# Altium schematic sheet Display.Schematic.SchDoc
size A
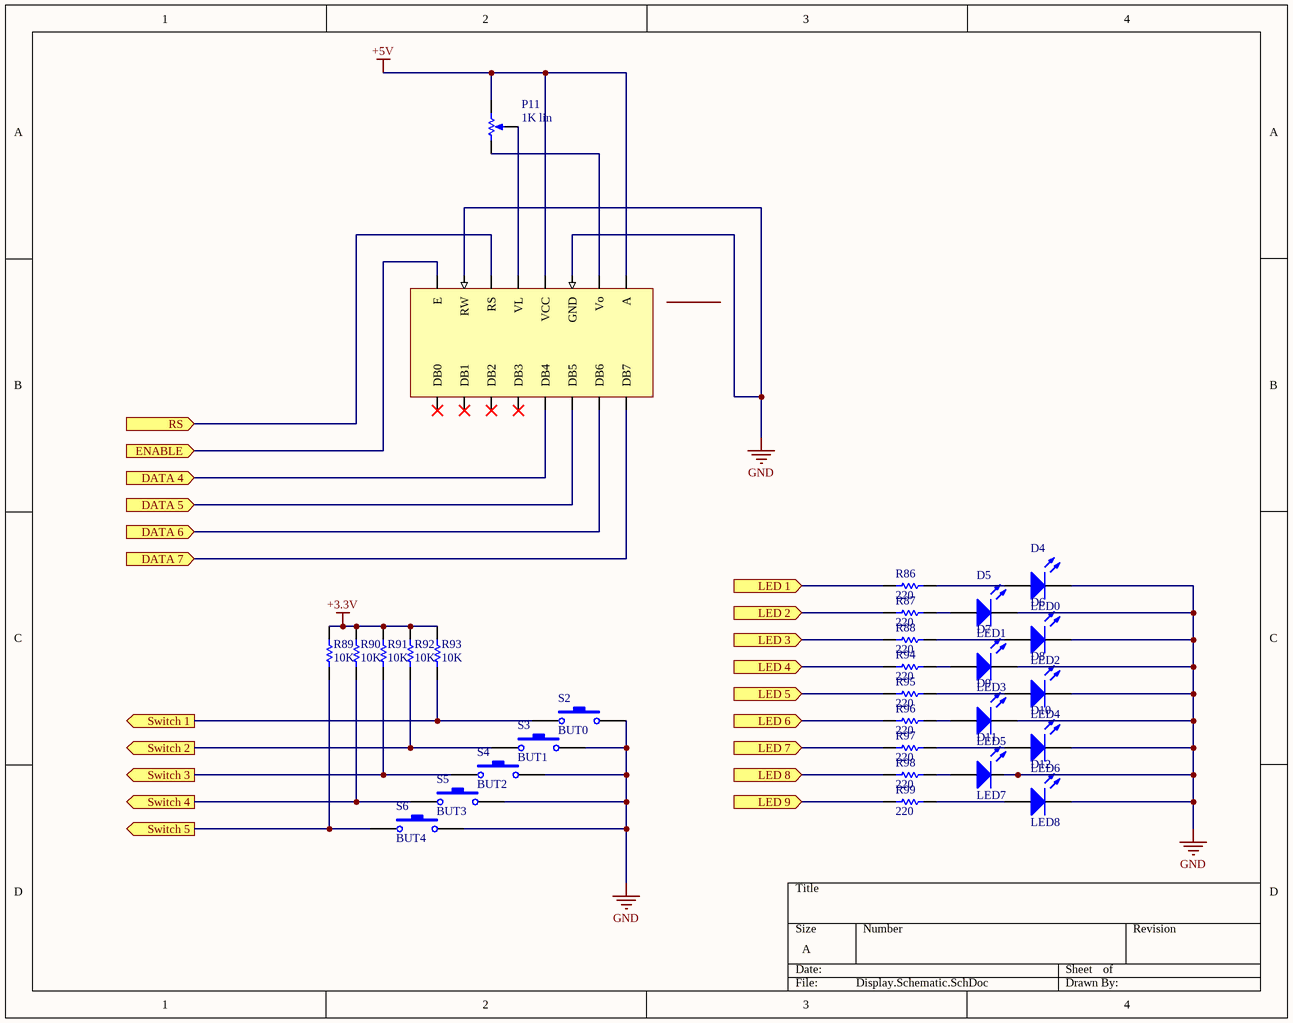
[diagram p0: Display.Schematic.SchDoc]

## Parts
D4  LED0  [LED-0]
D5  LED1  [LED-0]
D6  LED2  [LED-0]
D7  LED3  [LED-0]
D8  LED4  [LED-0]
D9  LED5  [LED-0]
D10  LED6  [LED-0]
D11  LED7  [LED-0]
D12  LED8  [LED-0]
Display  16x2 LCD  [Display]  (value not drawn)
P11  1K lin  [VR5]
R86  220  [CAPC1608N]
R87  220  [CAPC1608N]
R88  220  [CAPC1608N]
R89  10K  [CAPC1608N]
R90  10K  [CAPC1608N]
R91  10K  [CAPC1608N]
R92  10K  [CAPC1608N]
R93  10K  [CAPC1608N]
R94  220  [CAPC1608N]
R95  220  [CAPC1608N]
R96  220  [CAPC1608N]
R97  220  [CAPC1608N]
R98  220  [CAPC1608N]
R99  220  [CAPC1608N]
S2  BUT0  [SPST-2]
S3  BUT1  [SPST-2]
S4  BUT2  [SPST-2]
S5  BUT3  [SPST-2]
S6  BUT4  [SPST-2]

## Ports
DATA 4 (in), DATA 5 (in), DATA 6 (in), DATA 7 (in), ENABLE (in), LED 1 (in), LED 2 (in), LED 3 (in), LED 4 (in), LED 5 (in), LED 6 (in), LED 7 (in), LED 8 (in), LED 9 (in), RS (in), Switch 1 (out), Switch 2 (out), Switch 3 (out), Switch 4 (out), Switch 5 (out)

## Nets
+3.3V: R89.2 R90.2 R91.2 R92.2 R93.2
+5V: Display.2(VCC) Display.16(A) P11.2(BOT)
GND: D4.2(K) D5.2(K) D6.2(K) D7.2(K) D8.2(K) D9.2(K) D10.2(K) D11.2(K) D12.2(K) Display.1(GND) Display.5(RW) S2.2 S3.2 S4.2 S5.2 S6.2
DATA 4: Display.10(DB4) ; port DATA 4
DATA 5: Display.9(DB5) ; port DATA 5
DATA 6: Display.8(DB6) ; port DATA 6
DATA 7: Display.7(DB7) ; port DATA 7
ENABLE: Display.6(E) ; port ENABLE
LED 1: R86.1 ; port LED 1
LED 2: R87.1 ; port LED 2
LED 3: R88.1 ; port LED 3
LED 4: R94.1 ; port LED 4
LED 5: R95.1 ; port LED 5
LED 6: R96.1 ; port LED 6
LED 7: R97.1 ; port LED 7
LED 8: R98.1 ; port LED 8
LED 9: R99.1 ; port LED 9
RS: Display.4(RS) ; port RS
Switch 1: R93.1 S2.1 ; port Switch 1
Switch 2: R92.1 S3.1 ; port Switch 2
Switch 3: R91.1 S4.1 ; port Switch 3
Switch 4: R90.1 S5.1 ; port Switch 4
Switch 5: R89.1 S6.1 ; port Switch 5
NetD4_1: D4.1(A) R86.2
NetD5_1: D5.1(A) R87.2
NetD6_1: D6.1(A) R88.2
NetD7_1: D7.1(A) R94.2
NetD8_1: D8.1(A) R95.2
NetD9_1: D9.1(A) R96.2
NetD10_1: D10.1(A) R97.2
NetD11_1: D11.1(A) R98.2
NetD12_1: D12.1(A) R99.2
NetDisplay_3: Display.3(VL) P11.3(TAP)
NetDisplay_15: Display.15(Vo) P11.1(TOP)

Not connected (* = marked no-connect by the designer): Display 11(DB3)* 12(DB2)* 13(DB1)* 14(DB0)*

## Library data of the parts
D4-D12 = LED0: Typical INFRARED GaAs LED; Published: 8-Jun-2000; LatestRevisionDate: 08-Jul-2005; LatestRevisionNote: Mech Layer 1 removed.; PackageReference: LED-0; Publisher: Altium Limited; PackageDescription: LED; 2 Leads
Display = Display
P11 = RPot: Potentiometer; Sim Note: Enter the Resistance value and the set point into parameter fields.; Set Position: 0.5; Value: 10K; Published: 8-Jun-2000; LatestRevisionDate: 17-Jul-2002; LatestRevisionNote: Re-released for DXP Platform.; PackageReference: VR5; Publisher: Altium Limited; PackageDescription: Variable Resistor, Thru-Hole; 3 Leads
R86 R87 R89-R93 = Res1: Resistor; Value: 1K; Published: 8-Jun-2000; LatestRevisionDate: 17-Jul-2002; LatestRevisionNote: Re-released for DXP Platform.; PackageReference: AXIAL-0.3; Publisher: Altium Limited; PackageDescription: Axial Device, Thru-Hole; 2 Leads; 0.3 in Pin Spacing
R88 R94-R99 = Res1: Resistor; Published: 8-Jun-2000; LatestRevisionDate: 17-Jul-2002; LatestRevisionNote: Re-released for DXP Platform.; PackageReference: AXIAL-0.3; Publisher: Altium Limited; PackageDescription: Axial Device, Thru-Hole; 2 Leads; 0.3 in Pin Spacing; Value: 220
S2-S6 = SW-PB: Switch; Published: 24-Mar-1999; LatestRevisionDate: 17-Jul-2002; LatestRevisionNote: Re-released for DXP Platform.; PackageReference: SPST-2; Publisher: Altium Limited; PackageDescription: Switch; 2 Leads